# Altium project P-S 0-30V 3A Line.PrjPcb
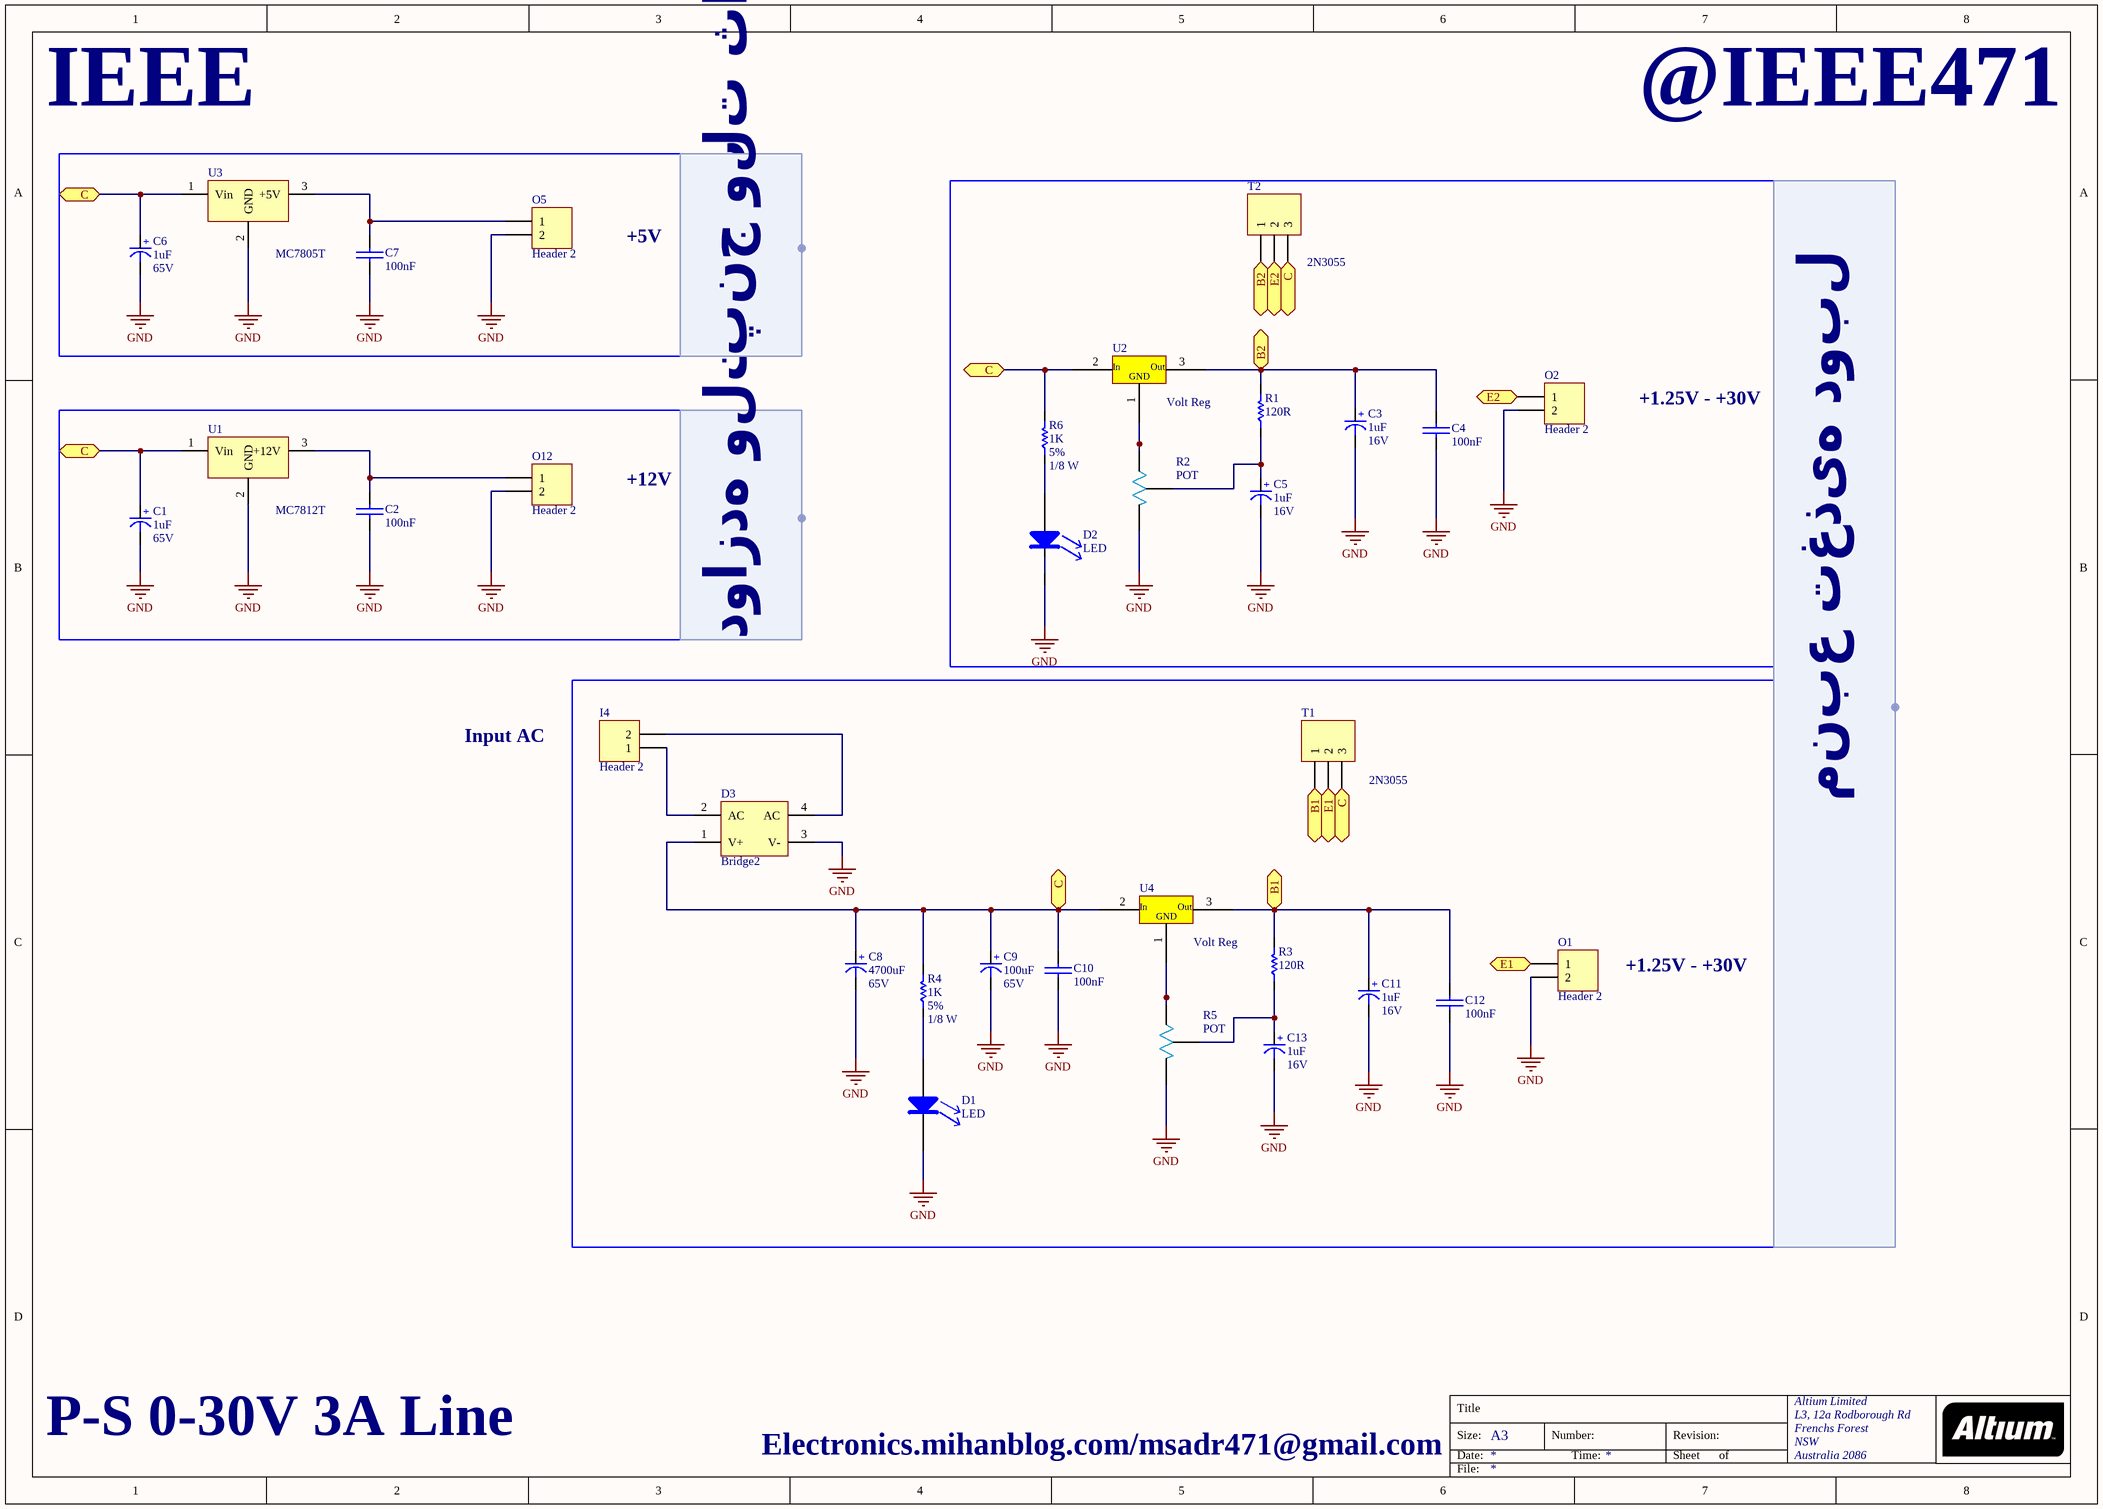
[diagram p0: P-S 0-30V 3A Line.SchDoc]
1 sheet, 33 parts. Net scope: flat (ports and power ports of the same name join across sheets).
Board file: P-S 0-30V 3A Line.PcbDoc

## Sheet P-S 0-30V 3A Line.SchDoc
size A3; Organization: Altium Limited; Address1: L3, 12a Rodborough Rd; Address2: Frenchs Forest; Address3: NSW; Address4: Australia 2086

### Parts
C1  Voltage: 65V  [cap 02]  (hidden comment: 1uF)
C2  100nF  [Cap - 100nF]
C3  Voltage: 16V  [cap 02]  (hidden comment: 1uF)
C4  100nF  [Cap - 100nF - 2]
C5  Voltage: 16V  [cap 02]  (hidden comment: 1uF)
C6  Voltage: 65V  [cap 02]  (hidden comment: 1uF)
C7  100nF  [Cap - 100nF]
C8  value 4700uF  Voltage: 65V  [CAP 05]  (hidden comment: 1uF)
C9  value 100uF  Voltage: 65V  [cap 02]  (hidden comment: 1uF)
C10  100nF  [Cap - 100nF - 2]
C11  Voltage: 16V  [cap 02]  (hidden comment: 1uF)
C12  100nF  [Cap - 100nF - 2]
C13  Voltage: 16V  [cap 02]  (hidden comment: 1uF)
D1  LED  [Blue LED 5mm]
D2  LED  [Blue LED 5mm]
D3  Bridge2  [D-46_6A]
I4  Header 2  [HDR1X2]
O1  Header 2  [HDR1X2]
O2  Header 2  [HDR1X2]
O5  Header 2  [HDR1X2]
O12  Header 2  [HDR1X2]
R1  value 120R  [Res-(1/4)]  (hidden comment: 1K)
R2  POT  [VOL_1]
R3  value 120R  [Res-(1/4)]  (hidden comment: 1K)
R4  Tolerance: 5%  Power: 1/8 W  [Res-(1/4)]  (hidden comment: 1K)
R5  POT  [VOL_1]
R6  Tolerance: 5%  Power: 1/8 W  [Res-(1/4)]  (hidden comment: 1K)
T1  2N3055  [HDR1X3]
T2  2N3055  [HDR1X3]
U1  MC7812T  [TO220V]
U2  Volt Reg  [TO220]
U3  MC7805T  [TO220V]
U4  Volt Reg  [TO220]

### Blocks framed on the sheet
+5V: C6 C7 O5 U3
+1.25V - +30V: C3-C5 D2 O2 R1 R2 R6 T2 U2
+12V: C1 C2 O12 U1
+1.25V - +30V: C8-C13 D1 D3 I4 O1 R3-R5 T1 U4

### Ports
B1, B2, C, E1, E2

### Harnesses
منبع تغذیه دوبل: 
دوازده ولت ثابت: 
پنج ولت ثابت: 

### Nets
GND: C1.2(-) C2.2(-) C3.2(-) C4.2(-) C5.2(-) C6.2(-) C7.2(-) C8.2(-) C9.2(-) C10.2(-) C11.2(-) C12.2(-) C13.2(-) D1.2 D2.2 D3.3(V-) O1.2 O2.2 O5.2 O12.2 R2.3 R5.3 U1.2(GND) U3.2(GND)
NetC1_1: C1.1(+) C6.1(+) C8.1(+) C9.1(+) C10.1(+) D3.1(V+) R4.2 R6.2 T1.3 T2.3 U1.1(Vin) U2.2 U3.1(Vin) U4.2 ; port C
NetC2_1: C2.1(+) O12.1 U1.3(+12V)
NetC3_1: C3.1(+) C4.1(+) R1.2 T2.1 U2.3 ; port B2
NetC5_1: C5.1(+) R1.1 R2.2
NetC7_1: C7.1(+) O5.1 U3.3(+5V)
NetC11_1: C11.1(+) C12.1(+) R3.2 T1.1 U4.3 ; port B1
NetC13_1: C13.1(+) R3.1 R5.2
NetD1_1: D1.1 R4.1
NetD2_1: D2.1 R6.1
NetD3_2: D3.2(AC) I4.1
NetD3_4: D3.4(AC) I4.2
NetO1_1: O1.1 T1.2 ; port E1
NetO2_1: O2.1 T2.2 ; port E2
NetR2_1: R2.1 U2.1
NetR5_1: R5.1 U4.1

### Notes on the sheet
- IEEE
- @IEEE471
- Input AC
- P-S 0-30V 3A Line
- Electronics.mihanblog.com/msadr471@gmail.com
- Title
- Size:
- Date:
- A3
- Number:
- Time:
- Revision:
- Sheet
- of
- File:
- (in symbol Volt reg 3) In; Out; GND

### Library data of the parts
C1 C3 C5 C6 C8 C9 C11 C13 = Cap-Polar: Polar Capacitor; Designer: Saeid Jorablo; Organazation: ControTec; Adding Date: 1387/12/20
  C1 C3 C5 C6 C11 C13: Value: 1uF
C2 C4 C7 C10 C12 = Cap-Bipolar: Bipolar Capacitor; Voltage: 100V; Designer: Saeid Jorablo; Organazation: ControTec; Adding Date: 1387/12/20; Value: 100nF
D1 D2 = LED Full color: Voltage: 3V; Current: 3mA; Color: Full coulor
D3 = Bridge2: Diode Bridge; Published: 24-Mar-1999; LatestRevisionDate: 17-Jul-2002; LatestRevisionNote: Re-released for DXP Platform.; PackageReference: D-46_6A; Publisher: Altium Limited; PackageDescription: Bridge Rectifier; 4 Terminals; Body 16.8 x 16.8 mm (typ); Pitch 10.67 mm
I4 O1 O2 O5 O12 = Header 2: Header, 2-Pin; LatestRevisionDate: 17-Jul-2002; LatestRevisionNote: Re-released for DXP Platform.; Publisher: Altium Limited
R1 R3 = Resistor: Tolerance: 5%; Power: 1/8 W
R4 R6 = Resistor: Value: 1K
T1 T2 = Header 3: Header, 3-Pin; LatestRevisionDate: 17-Jul-2002; LatestRevisionNote: Re-released for DXP Platform.; Publisher: Altium Limited
U2 U4 = Volt reg 3: LM337